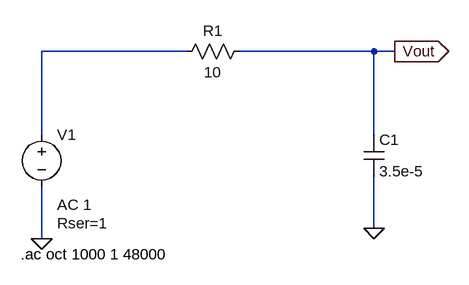
[diagram p0: schematic series_RC.asc]
series_RC.asc, the LTspice schematic file:
Version 4
SHEET 1 880 680
WIRE -688 64 -912 64
WIRE -400 64 -608 64
WIRE -368 64 -400 64
WIRE -912 192 -912 64
WIRE -400 192 -400 64
WIRE -400 336 -400 256
WIRE -912 352 -912 272
FLAG -912 352 0
FLAG -400 336 0
FLAG -368 64 Vout
IOPIN -368 64 Out
SYMBOL voltage -912 176 R0
WINDOW 123 24 124 Left 2
WINDOW 39 24 152 Left 2
SYMATTR Value2 AC 1
SYMATTR SpiceLine Rser=1
SYMATTR InstName V1
SYMATTR Value ""
SYMBOL res -592 48 R90
WINDOW 0 0 56 VBottom 2
WINDOW 3 32 56 VTop 2
SYMATTR InstName R1
SYMATTR Value 10
SYMBOL cap -416 192 R0
SYMATTR InstName C1
SYMATTR Value 3.5e-5
TEXT -944 376 Left 2 !.ac oct 1000 1 48000

The netlist it stands for:
* series_RC.asc
V1 N001 0 AC 1 Rser=1
R1 Vout N001 10
C1 Vout 0 3.5e-5
.ac oct 1000 1 48000
.backanno
.end